# EAGLE design esptoy_v1 (EAGLE 7.1.0)
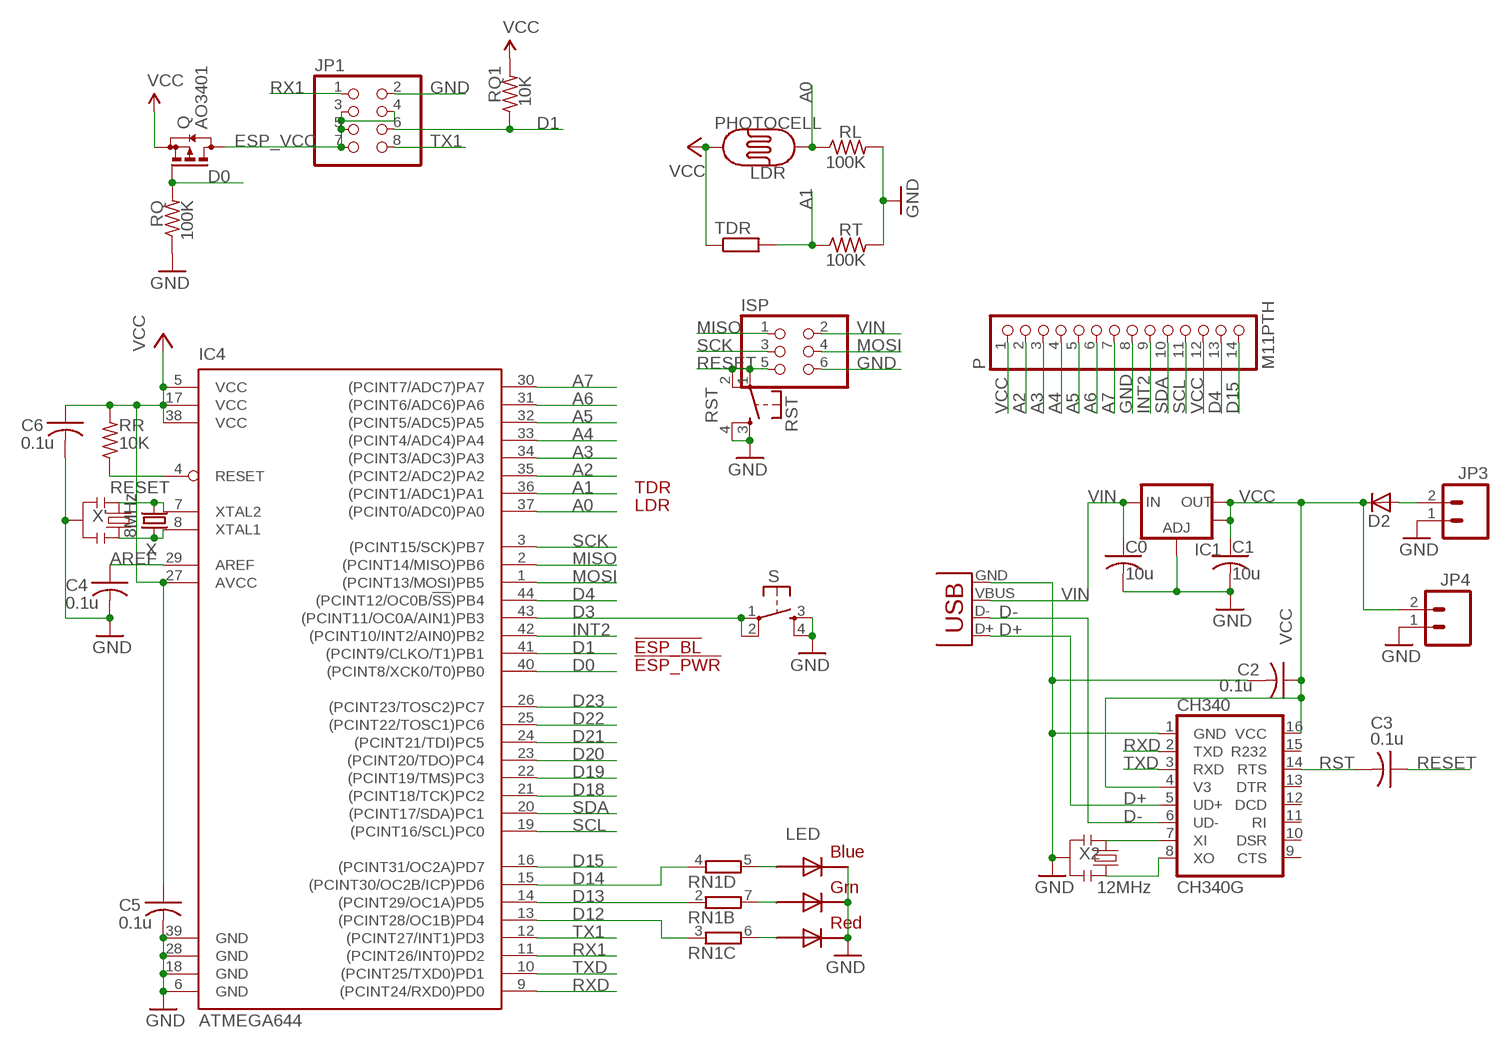
[diagram p0: schematic, sheet 1]

## Parts
C0  10u  C-USC0805K  [C0805K]
C1  10u  C-USC0805K  [C0805K]
C2  0.1u  C-USC0603  [C0603]
C3  0.1u  C-USC0603  [C0603]
C4  0.1u  C-USC0603  [C0603]
C5  0.1u  C-USC0603K  [C0603K]
C6  0.1u  C-USC0603  [C0603]
CH340  CH340G  [SO16]
D2  DIODESMA  [SMA-DIODE]
IC1  V_REG_LM1117SOT223  [SOT223]
IC4  ATMEGA644  ATMEGA644A  [TQFP44]
ISP  PINHD-2X3  [2X03]
JP1  PINHD-2X4  [2X04]
JP3  M02-JST-2MM-SMT  [S2B-PH]
JP4  M02PTH  [1X02]
LDR  PHOTOCELL  PHOTOCELLPTH  [PHOTOCELL]
LED  RGBLED5050  [RGBLED5050]
P  M11PTH  PINHD-1X14-CB  [1X14-CB]
Q  AO3401  BSS84  [SOT23]
RL  100K  R-US_R0805  [R0805]
RN1  4R-NEXB38V  [EXB38V]
RQ  100K  R-US_R0805  [R0805]
RQ1  10K  R-US_R0603  [R0603]
RR  10K  R-US_R0603  [R0603]
RST  RST  TAC_SWITCHSMD  [TACTILE_SWITCH_SMD]
RT  100K  R-US_R0805  [R0805]
S  TAC_SWITCHSMD  [TACTILE_SWITCH_SMD]
TDR  R-EU_V526-0  [V526-0]
X  8MHz  CRYSTALTC26V  [TC26V]
X1  USBSMD  [USB-MINIB]
X2  12MHz  RESONATORSMD  [RESONATOR-SMD]
X'  12MHz  RESONATORSMD  [RESONATOR-SMD]

## Nets
A0: IC4.37((PCINT0/ADC0)PA0) LDR.1 RL.1
A1: IC4.36((PCINT1/ADC1)PA1) RT.1 TDR.2
A2: IC4.35((PCINT2/ADC2)PA2) P.2
A3: IC4.34((PCINT3/ADC3)PA3) P.3
A4: IC4.33((PCINT4/ADC4)PA4) P.4
A5: IC4.32((PCINT5/ADC5)PA5) P.5
A6: IC4.31((PCINT6/ADC6)PA6) P.6
A7: IC4.30((PCINT7/ADC7)PA7) P.7
AREF: C4.1 IC4.29(AREF)
D0: IC4.40((PCINT8/XCK0/T0)PB0) Q.1(G) RQ.2
D1: IC4.41((PCINT9/CLKO/T1)PB1) JP1.6 RQ1.1
D3: IC4.43((PCINT11/OC0A/AIN1)PB3) S.1 S.2
D4: IC4.44((PCINT12/OC0B/!SS!)PB4) P.13
D12: IC4.13((PCINT28/OC1B)PD4) RN1.3
D13: IC4.14((PCINT29/OC1A)PD5) RN1.2
D14: IC4.15((PCINT30/OC2B/ICP)PD6) RN1.4
D15: IC4.16((PCINT31/OC2A)PD7) P.14
D18: IC4.21((PCINT18/TCK)PC2)
D19: IC4.22((PCINT19/TMS)PC3)
D20: IC4.23((PCINT20/TDO)PC4)
D21: IC4.24((PCINT21/TDI)PC5)
D22: IC4.25((PCINT22/TOSC1)PC6)
D23: IC4.26((PCINT23/TOSC2)PC7)
D+: CH340.5(UD+) X1.D+
D-: CH340.6(UD-) X1.D-
ESP_VCC [power]: JP1.3 JP1.4 JP1.5 JP1.7 Q.3(D)
GND: C0.2 C1.2 C2.2 C4.2 C5.2 C6.2 CH340.1(GND) IC1.1(ADJ) IC4.6(GND) IC4.18(GND) IC4.28(GND) IC4.39(GND) ISP.6 JP1.2 JP3.1 JP4.1 LED.4(BLUE_C) LED.5(RED_C) LED.6(GREEN_C) P.8 RL.2 RQ.1 RST.3 RST.4 RT.2 S.3 S.4 X1.GND X2.2 X'.2
INT2: IC4.42((PCINT10/INT2/AIN0)PB2) P.9
MISO: IC4.2((PCINT14/MISO)PB6) ISP.1
MOSI: IC4.1((PCINT13/MOSI)PB5) ISP.4
N$1 [power]: D2.A JP3.2
N$2: LED.3(BLUE_A) RN1.5
N$6: LED.1(GREEN_A) RN1.7
N$7: LED.2(RED_A) RN1.6
N$11: CH340.7(XI) X2.1
N$13: CH340.8(XO) X2.3
N$15: IC4.7(XTAL2) X'.1 X.2
N$19: IC4.8(XTAL1) X'.3 X.1
RESET: C3.1 IC4.4(RESET) ISP.5 RR.1 RST.1 RST.2
RST: C3.2 CH340.14(RTS)
RX1: IC4.11((PCINT26/INT0)PD2) JP1.1
RXD: CH340.2(TXD) IC4.9((PCINT24/RXD0)PD0)
SCK: IC4.3((PCINT15/SCK)PB7) ISP.3
SCL: IC4.19((PCINT16/SCL)PC0) P.11
SDA: IC4.20((PCINT17/SDA)PC1) P.10
TX1: IC4.12((PCINT27/INT1)PD3) JP1.8
TXD: CH340.3(RXD) IC4.10((PCINT25/TXD0)PD1)
VCC [power]: C1.1 C2.1 C5.1 C6.1 CH340.4(V3) CH340.16(VCC) D2.C IC1.2(OUT) IC1.4(OUT) IC4.5(VCC) IC4.17(VCC) IC4.27(AVCC) IC4.38(VCC) JP4.2 LDR.2 P.1 P.12 Q.2(S) RQ1.2 RR.2 TDR.1
VIN [power]: C0.1 IC1.3(IN) ISP.2 X1.VBUS
Unconnected: CH340.9(CTS) CH340.10(DSR) CH340.11(RI) CH340.12(DCD) CH340.13(DTR) CH340.15(R232) RN1.1 RN1.8

## Notes on the sheet
- TDR
- LDR
- !ESP_BL
- !ESP_PWR

## Library data of the parts
C0 C1 = adafruit2013:C-US: CAPACITOR, American symbol
C2-C6 = adafruit:C-US: CAPACITOR, American symbol
CH340 = SparkFunNew:CH340
D2 = SparkFun:DIODE: Diode These are standard reverse protection diodes and small signal diodes. SMA package can handle up to about 1A. SOD-323 can handle about 200mA. What the SOD-323 package when ordering, there are some mfgs out there that are 5-pin packages.
IC1 = SparkFun:V_REG_LM1117: Voltage Regulator LM1117 Standard adjustable voltage regulator but in SMD form. Spark Fun Electronics SKU : COM-00595
IC4 = atmel:ATMEGA644: 8-bit Microcontroller with 64K Bytes In-System Programmable Flash Source: http://www.atmel.com/dyn/resources/prod_documents/doc2593.pdf; MPN: ATMEGA644PV-10AU; OC_FARNELL: 1455123; OC_NEWARK: 58M3748
ISP = pinhead:PINHD-2X3: PIN HEADER
JP1 = pinhead:PINHD-2X4: PIN HEADER
JP3 JP4 = SparkFun:M02: Header 2 Standard 2-pin 0.1" header. Use with straight break away headers (SKU : PRT-00116), right angle break away headers (PRT-00553), swiss pins (PRT-00743), machine pins (PRT-00117), and female headers (PRT-00115). Molex polarized connector foot print use with SKU : PRT-08233 with associated crimp pins and housings.
LDR = SparkFunNew:PHOTOCELL: Photocell Also known as a CdS photoresistor. This is a low cost way to detect light levels. Resistance decreases with more incoming light. SparkFun SKU: SEN-09088
LED = adafruit:RGBLED: For 5050 RGB LEDs, the order of the LEDs may vary from one manufacturer to another!
P = adafruit:PINHD-1X14: PIN HEADER
Q = transistor-small-signal:BSS84: P-CHANNEL MOS FET
RL RQ RQ1 RR RT = adafruit2013:R-US_: RESISTOR, American symbol
RN1 = resistor-dil:4R-N: Array Chip Resistor Source: RS Component / Phycomp; OC_FARNELL: unknown; OC_NEWARK: unknown
RST S = SparkFunNew:TAC_SWITCH: Momentary Switch Button commonly used for reset or general input. Spark Fun Electronics SKU : COM-00097
TDR = resistor:R-EU_: RESISTOR, European symbol; SPICEPREFIX: R
X = crystal:CRYSTAL: CRYSTAL; OC_FARNELL: unknown; OC_NEWARK: unknown
X1 = SparkFun:USB: USB Connectors USB-B-PTH is fully proven SKU : PRT-00139 USB-miniB is fully proven SKU : PRT-00587 USB-A-PCB is untested. USB-A-H is throughly reviewed, but untested. Spark Fun Electronics SKU : PRT-00437 USB-B-SMT is throughly reviewed, but untested. Needs silkscreen touching up. USB-A-S has not been used/tested USB-MB-H has not been used/tested
X2 X' = SparkFunNew:RESONATOR: Resonator Small SMD resonator. This is the itty bitty 10/20MHz resonators with built in caps. CSTCE10M0G55 and CSTCE20M0V53. Footprint has been reviewed closely but hasn't been tested yet.

## Net classes
0 default: width 0.178 mm, clearance 0.178 mm
1 power: width 0.305 mm, clearance 0.203 mm

## Board
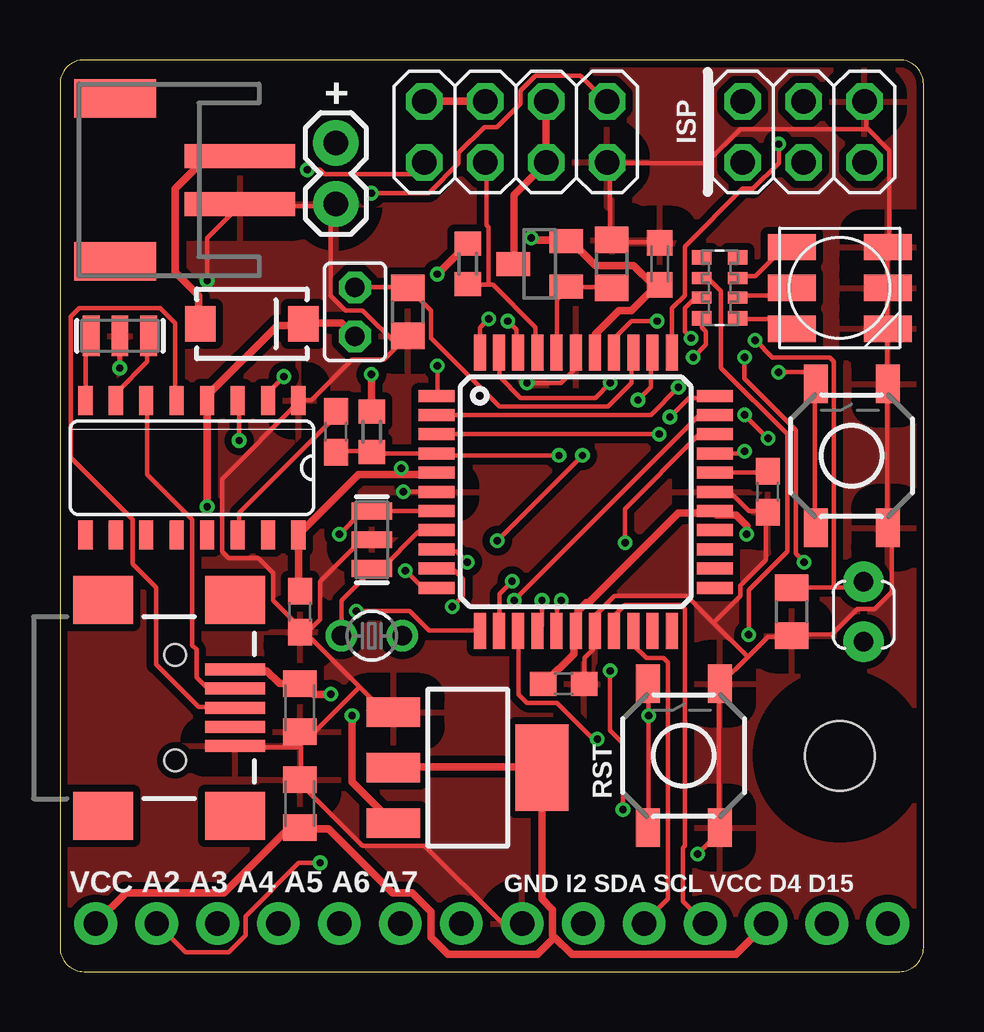
[diagram p1: board, top side]
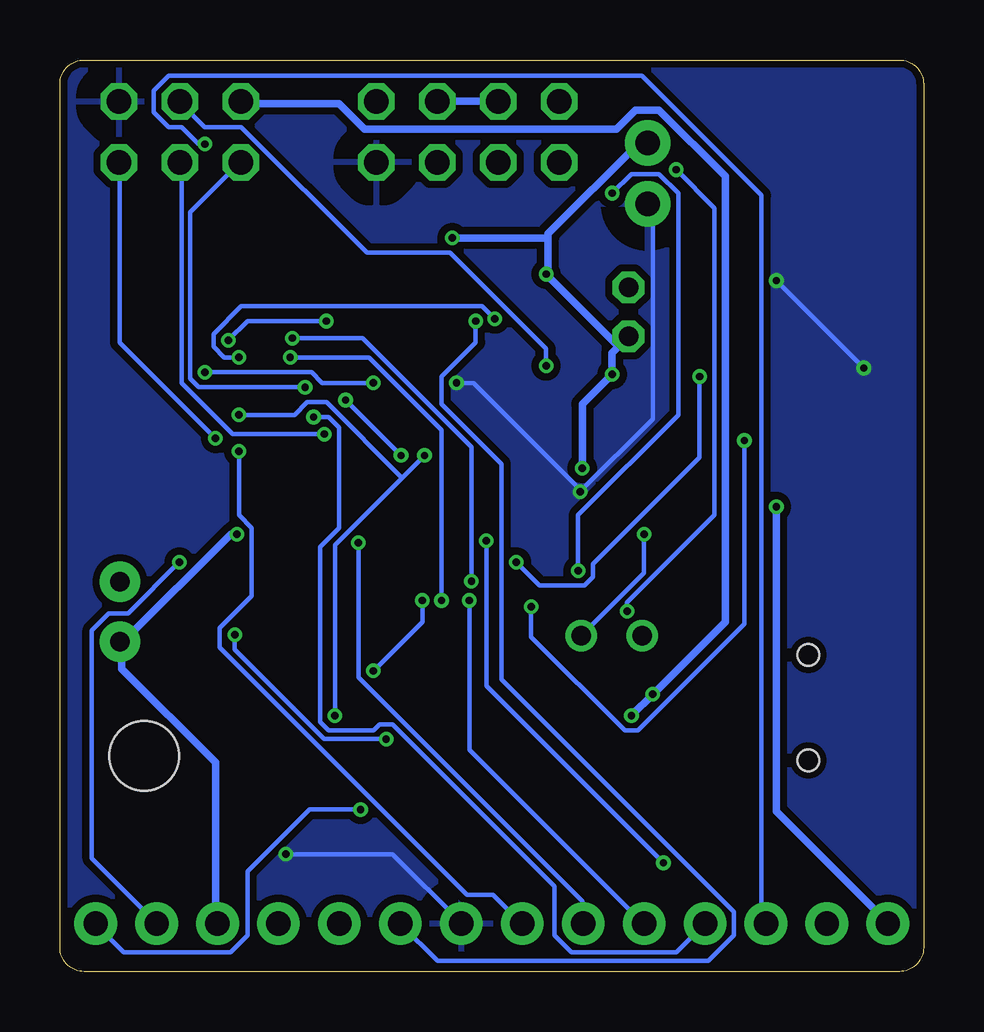
[diagram p2: board, bottom side, seen from below]

Size 36 x 38 mm. Coordinates in mm from the lower left corner, seen from the top.
Outline: 1,0 35,0 arc90 36,1 36,37 arc90 35,38 1,38 arc90 0,37 0,1 arc90 1,0
Copper layers (1*16): Top 0.035mm / dielectric 1.5mm / Bottom 0.035mm
Design rules "Fusion_eagle_rule_v1.1 *": minimum track width 6mil, minimum drill 12mil, track to track 6mil, track to pad 6mil, pad to pad 6mil, via to via 6mil, smd to smd 0mil, copper to edge 10mil, drill to drill 10mil, minimum pad ring 10mil, minimum via ring 6mil, stop-mask expansion 2mil, vias tented up to drill 100mil, thermal gap 40mil
Holes 2.9 mm at 32.5,9
tRestrict: area 29.2,5.7 to 35.8,12.3
vRestrict: area 0.4,3.2 to 30.4,4.2

### Footprints (pad centres in the part's own frame; a part is rotated, then mirrored left to right if it is on the bottom)
C0805K = smd 1.1 x 1.4: 1 -1,0; 2 1,0
C0603 = smd 1.1 x 1: 1 -0.85,0; 2 0.85,0
C0603K = smd 1.05 x 1.08: 1 -0.875,0; 2 0.875,0
SO16 = smd 0.6 x 1.2: 1 -4.445,-2.8; 2 -3.175,-2.8; 3 -1.905,-2.8; 4 -0.635,-2.8; 5 0.635,-2.8; 6 1.905,-2.8; 7 3.175,-2.8; 8 4.445,-2.8; 9 4.445,2.8; 10 3.175,2.8; 11 1.905,2.8; 12 0.635,2.8; 13 -0.635,2.8; 14 -1.905,2.8; 15 -3.175,2.8; 16 -4.445,2.8
SMA-DIODE = smd 1.27 x 1.47: A -2.15,0; C 2.15,0
SOT223 = smd 1.219 x 2.235: 1 -2.311,-3.099; 2 0,-3.099; 3 2.311,-3.099 | smd 3.6 x 2.2: 4 0,3.099
TQFP44 = smd 1.5 x 0.5: 1 -5.8,4; 2 -5.8,3.2; 3 -5.8,2.4; 4 -5.8,1.6; 5 -5.8,0.8; 6 -5.8,0; 7 -5.8,-0.8; 8 -5.8,-1.6; 9 -5.8,-2.4; 10 -5.8,-3.2; 11 -5.8,-4; 23 5.8,-4; 24 5.8,-3.2; 25 5.8,-2.4; 26 5.8,-1.6; 27 5.8,-0.8; 28 5.8,0; 29 5.8,0.8; 30 5.8,1.6; 31 5.8,2.4; 32 5.8,3.2; 33 5.8,4 | smd 0.5 x 1.5: 12 -4,-5.8; 13 -3.2,-5.8; 14 -2.4,-5.8; 15 -1.6,-5.8; 16 -0.8,-5.8; 17 0,-5.8; 18 0.8,-5.8; 19 1.6,-5.8; 20 2.4,-5.8; 21 3.2,-5.8; 22 4,-5.8; 34 4,5.8; 35 3.2,5.8; 36 2.4,5.8; 37 1.6,5.8; 38 0.8,5.8; 39 0,5.8; 40 -0.8,5.8; 41 -1.6,5.8; 42 -2.4,5.8; 43 -3.2,5.8; 44 -4,5.8
2X03 = drill 1.016 octagon: 1 -2.54,-1.27; 2 -2.54,1.27; 3 0,-1.27; 4 0,1.27; 5 2.54,-1.27; 6 2.54,1.27
2X04 = drill 1.016 octagon: 1 -3.81,-1.27; 2 -3.81,1.27; 3 -1.27,-1.27; 4 -1.27,1.27; 5 1.27,-1.27; 6 1.27,1.27; 7 3.81,-1.27; 8 3.81,1.27
S2B-PH = smd 1 x 4.6: 1 -1,-3.7; 2 1,-3.7 | smd 1.6 x 3.4: NC1 -3.4,1.5; NC2 3.4,1.5
1X02 = drill 1.016 pad 1.88: 1 0,0; 2 2.54,0
PHOTOCELL = drill 0.8 pad 1.676: 1 -1.246,0; 2 1.246,0
RGBLED5050 = smd 2 x 1.1: 1 -2,1.7; 2 -2,0; 3 -2,-1.7; 4 2,-1.7; 5 2,0; 6 2,1.7
1X14-CB = drill 1.016 pad 1.778: 1 -16.51,0; 2 -13.97,0; 3 -11.43,0; 4 -8.89,0; 5 -6.35,0; 6 -3.81,0; 7 -1.27,0; 8 1.27,0; 9 3.81,0; 10 6.35,0; 11 8.89,0; 12 11.43,0; 13 13.97,0; 14 16.51,0
SOT23 = smd 1 x 1.4: 1 -0.95,-1.1; 2 0.95,-1.1; 3 0,1.1
R0805 = smd 1.1 x 1.4: 1 -1,0; 2 1,0
EXB38V = smd 0.6 x 0.8: 1 -1.275,-0.75; 4 1.275,-0.75; 5 1.275,0.75; 8 -1.275,0.75 | smd 0.5 x 0.8: 2 -0.4,-0.75; 3 0.4,-0.75; 6 0.4,0.75; 7 -0.4,0.75
R0603 = smd 1 x 1.1: 1 -0.85,0; 2 0.85,0
TACTILE_SWITCH_SMD = smd 1.6 x 1: 1 -3,1.5; 2 3,1.5; 3 -3,-1.5; 4 3,-1.5
V526-0 = drill 0.813 octagon: 1 -1.016,0; 2 1.016,0
TC26V = drill 0.813: 1 -1.27,0; 2 1.27,0
USB-MINIB = smd 2.5 x 0.5: D+ 2.5,0; D- 2.5,0.8; GND 2.5,-1.6; ID 2.5,-0.8; VBUS 2.5,1.6 | smd 2.5 x 2: GND@1 -3,-4.5; GND@2 -3,4.5; GND@3 2.5,4.5; GND@4 2.5,-4.5 | hole 0.9: 0,2.2; 0,-2.2
RESONATOR-SMD = smd 0.7 x 1.7: 1 -1.2,0; 2 0,0; 3 1.2,0

### Placement (x,y rotation side)
C0  10,11 270 top
C1  10,7 90 top
C2  10,15 270 top
C3  11.5,22.5 90 top
C4  29.5,20 270 top
C5  25,29.5 90 top
C6  21,12 0 top
CH340  5.5,21 180 top
D2  8,27 0 top
IC1  17,8.5 270 top
IC4  21.5,20 0 top
ISP  31,35 0 top
JP1  19,35 180 top
JP3  3.8,33 90 top
JP4  11.5,32 90 top
LDR  33.5,15 270 top
LED  32.5,28.5 0 top
P  18,2 0 top
Q  20,29.5 90 top
RL  30.5,15 270 top
RN1  27.5,28.5 270 top
RQ  23,29.5 270 top
RQ1  17,29.5 90 top
RR  13,22.5 90 top
RST  26,9 90 top
RT  14.5,27.5 270 top
S  33,21.5 90 top
TDR  12.3,27.5 90 top
X  13,14 0 top
X1  4.8,11 0 top
X2  2.5,26.5 180 top
X'  13,18 270 top

### Tracks (layer width: path | path; a pad name or v marks a point on that pad's centre or on a via)
A0  (via drill 0.3)
  Top 0.178: 32.27,16 33.25,16 33.43,16.18 LDR.1 | 32.27,16 30.58,16 RL.1 | v24.89,27.11 23.82,27.11 23.11,26.4 23.11,25.87 IC4.37 | v28.98,26.31 29.69,25.6 32.09,25.6 32.27,25.43 32.27,16
  Bottom 0.178: v24.89,27.11 28.18,27.11 v28.98,26.31
A1
  Top 0.178: TDR.2 12.36,28.54 14.49,28.54 RT.1 14.58,28.45 15.47,27.56 15.47,26.4 18.31,23.56 22.85,23.56 23.82,24.54 23.82,25.78 IC4.36
A2  (via drill 0.3)
  Top 0.178: v24.09,23.82 24.62,24.36 24.62,25.78 IC4.35 | v18.22,17.96 v21.78,21.51 | v10.85,4.53 9.96,4.53 7.73,2.31 7.73,1.51 7.02,0.8 5.25,0.8 4.09,1.96 P.2
  Bottom 0.178: v21.78,21.51 v24.09,23.82 | v18.22,17.96 18.22,11.91 v10.85,4.53
A3  (via drill 0.3)
  Top 0.178: v29.96,34.49 29.96,33.69 28.89,32.63 28.45,32.63 26.05,30.23 26.05,28.18 25.51,27.65 25.51,25.87 IC4.34
  Bottom 0.178: v29.96,34.49 30.23,34.49 30.94,35.2 31.47,35.2 32.09,35.83 32.09,36.72 31.47,37.34 11.73,37.34 6.76,32.36 6.76,2.22 6.58,2.04 P.3
A4  (via drill 0.3)
  Top 0.178: v25.43,23.11 26.23,23.91 27.29,23.91 IC4.33
  Bottom 0.178: v25.43,23.11 24.8,23.11 24.36,22.67 24.36,18.49 25.16,17.69 25.16,10.4 24.8,10.05 22.94,10.05 22.67,10.31 22.14,10.31 15.38,3.56 15.38,1.51 14.67,0.8 10.31,0.8 9.16,1.96 P.4
A5  (via drill 0.3)
  Top 0.178: v18.94,15.47 26.58,23.11 27.29,23.11 IC4.32
  Bottom 0.178: v18.94,15.47 18.94,9.25 11.73,2.04 P.5
A6  (via drill 0.3)
  Top 0.178: v23.56,17.87 23.56,19.29 26.58,22.31 27.29,22.31 IC4.31
  Bottom 0.178: v23.56,17.87 23.56,12.27 14.22,2.93 14.22,2.04 P.6
A7  (via drill 0.3)
  Top 0.178: v28.54,21.69 28.45,21.6 27.38,21.6 IC4.30
  Bottom 0.178: v28.54,21.69 28.54,19.02 28,18.49 28,15.65 29.34,14.31 29.34,13.51 19.02,3.2 17.96,3.2 16.8,2.04 P.7
AREF
  Top 0.178: C4.1 29.43,20.8 27.38,20.8 IC4.29
D0
  Top 0.178: RQ.2 22.94,28.54 21.16,28.54 Q.1 21.16,28.45 20.71,28 20.71,25.87 IC4.40
D1
  Top 0.178: 17.87,28.63 18.05,28.63 19.82,26.85 19.82,25.87 IC4.41 | 17.87,28.63 17.07,28.63 RQ1.1 | 17.87,28.63 17.87,31.03 17.78,31.11 17.78,33.69 JP1.6
D3  (via drill 0.3)
  Top 0.178: v22.94,24.54 22.31,23.91 19.2,23.91 18.31,24.8 18.31,25.78 IC4.43 | v29.96,24.98 31.03,24.98 31.47,24.54 S.2 31.47,24.45 31.47,18.58 S.1
  Bottom 0.178: v22.94,24.54 25.07,24.54 25.51,24.98 v29.96,24.98
D4  (via drill 0.3)
  Top 0.178: v17.87,27.2 17.51,26.85 17.51,25.87 IC4.44 | v28.54,25.6 28.54,24.71 30.67,22.58 30.67,17.42 v31.03,17.07
  Bottom 0.178: v17.87,27.2 18.4,27.74 28.45,27.74 29.6,26.58 29.6,26.05 29.16,25.6 v28.54,25.6 | v31.03,17.07 33.16,14.94 33.96,14.94 34.67,14.22 34.67,4.71 32,2.04 P.13
D12  (via drill 0.3)
  Top 0.178: v26.31,26.4 26.05,26.67 26.05,27.65 26.49,28.09 26.67,28.09 RN1.3 | v18.85,16.27 18.31,15.73 18.31,14.22 IC4.13
  Bottom 0.178: v26.31,26.4 23.38,26.4 18.85,21.87 v18.85,16.27
D13  (via drill 0.3)
  Top 0.178: v28.71,14.05 28.71,15.91 30.32,17.51 30.32,22.4 27.56,25.16 27.56,28.36 27.03,28.89 RN1.2 | v22.4,9.69 22.23,9.69 20.71,11.2 19.47,11.2 19.11,11.56 19.11,14.13 IC4.14
  Bottom 0.178: v28.71,14.05 28.71,13.42 24.98,9.69 v22.4,9.69
D14  (via drill 0.3)
  Top 0.178: v26.4,25.6 26.94,26.14 26.94,26.67 26.76,26.85 26.76,27.2 RN1.4 | v20.09,15.47 20.09,14.4 19.91,14.22 IC4.15
  Bottom 0.178: v26.4,25.6 23.11,25.6 20.09,22.58 v20.09,15.47
D15  (via drill 0.3)
  Top 0.178: v20.89,15.47 20.71,15.29 20.71,14.22 IC4.16 | v22.94,12.54 22.94,10.05 23.47,9.51 v23.47,6.76
  Bottom 0.178: v20.89,15.47 20.89,14.58 v22.94,12.54 | v23.47,6.76 25.6,6.76 28.18,4.18 28.18,1.51 28.89,0.8 33.34,0.8 34.49,1.96 P.14
D+
  Top 0.178: CH340.5 4.8,23.82 4.8,27.03 4.18,27.65 0.8,27.65 0.45,27.29 0.45,21.43 3.02,18.85 3.02,16.98 4,16 4,12.8 5.78,11.02 7.29,11.02 X1.D+
D-
  Top 0.178: CH340.6 3.65,23.74 3.65,20.71 5.51,18.85 5.51,13.6 5.69,13.42 5.69,12.27 6.13,11.82 7.29,11.82 X1.D-
ESP_VCC
  Top 0.305: JP1.7 15.2,36.27 17.69,36.27 JP1.5 | Q.3 18.94,29.52 18.94,32.36 20.27,33.69 JP1.4 20.27,33.87 20.27,36.18 JP1.3
  Bottom 0.305: JP1.5 17.78,36.27 JP1.3
GND  (via drill 0.3)
  Top 0.178: IC4.28 27.38,19.91 28,19.91 28.71,19.2 29.43,19.2 C4.2 29.43,19.11 29.43,17.16 28.36,16.09 28.36,15.65 27.25,14.54 | C6.2 21.87,12 21.87,13.07 22.23,13.42 22.23,14.13 IC4.18 22.31,14.22 22.31,14.85 23.11,15.65 26.14,15.65 27.25,14.54 | 28.67,13.11 27.56,12 RST.4 27.47,11.91 27.47,6.04 RST.3 27.47,5.96 27.47,5.78 v26.58,4.89 | 28.67,13.11 29.52,13.96 30.49,13.96 RL.2 30.58,14.05 32.18,14.05 33.25,15.11 33.96,15.11 34.67,15.82 34.67,18.4 34.58,18.49 S.3 34.49,18.58 34.49,24.45 S.4 34.49,24.54 34.49,26.76 LED.4 34.49,26.85 34.49,28.45 LED.5 34.49,28.54 34.49,30.14 LED.6 34.58,30.23 34.58,34.23 33.65,35.16 | 28.67,13.11 27.25,14.54 | C5.2 24.98,30.4 23.11,30.4 23.02,30.49 RQ.1 22.94,30.58 22.94,33.6 22.85,33.69 JP1.2 22.94,33.69 26.94,33.69 28.36,35.12 33.6,35.12 33.65,35.16 | 33.65,35.16 33.6,35.2 33.6,36.18 ISP.6 | 10.05,9.34 10.05,9.96 C0.2 10.13,9.96 10.58,9.96 12.49,11.87 | 10.05,9.34 10.05,8 C1.2 9.96,7.91 12.62,5.25 15.2,5.25 18.4,2.04 19.2,2.04 P.8 | 10.05,9.34 7.38,9.34 X1.GND | 12.49,11.87 13.51,10.85 13.87,10.85 IC1.1 | 12.49,11.87 10.22,14.13 10.05,14.13 C2.2 | X'.2 12.98,17.96 12.54,17.96 10.85,16.27 10.85,14.67 10.31,14.13 C2.2 | v2.49,25.16 2.49,26.49 X2.2 | v6.13,28.8 6.13,30.58 7.47,31.91 JP3.1 7.56,31.91 11.38,31.91 JP4.1 11.47,31.91 11.29,31.74 11.29,28.18 11.91,27.56 12.62,27.56 14.05,26.14 RT.2 13.51,25.51 12.18,25.51 10.49,23.82 9.96,23.82 CH340.1 9.96,23.74 6.76,20.54 6.76,17.51 7.02,17.25 8.27,17.25 8.89,16.62 8.89,15.47 9.96,14.4 9.96,14.22 C2.2 | v14.31,20 15.65,20 IC4.6 | v19.47,24.54 20.89,24.54 21.43,25.07 21.43,25.78 IC4.39
  Bottom 0.178: v6.13,28.8 v2.49,25.16 | JP4.1 11.47,31.91 11.29,31.74 11.29,23.02 v14.31,20 14.31,20.09 18.76,24.54 v19.47,24.54 | v26.58,4.89 22.14,4.89 19.29,2.04 P.8
  pour Top (isolate 0.305): 0,38 36,38 36,0 0,0
  pour Bottom (isolate 0.305): 0,38 36,38 36,0 0,0
INT2  (via drill 0.3)
  Top 0.178: v18.67,27.11 19.02,26.76 19.02,25.87 IC4.42
  Bottom 0.178: v18.67,27.11 18.67,26.23 20.09,24.8 20.09,23.65 17.6,21.16 17.6,12.18 7.91,2.49 7.91,1.51 8.98,0.45 20.27,0.45 21.78,1.96 P.9
MISO  (via drill 0.3)
  Top 0.178: v25.78,24.36 24.62,23.2 15.73,23.2 IC4.2
  Bottom 0.178: v25.78,24.36 30.23,24.36 30.58,24.71 30.58,31.65 28.54,33.69 ISP.1
MOSI  (via drill 0.3)
  Top 0.178: v15.73,25.25 15.73,24 IC4.1
  Bottom 0.178: v15.73,25.25 15.73,25.96 19.74,29.96 23.2,29.96 28.45,35.2 29.96,35.2 30.94,36.18 ISP.4
N$1
  Top 0.305: D2.A 5.78,27.03 5.78,28.18 4.8,29.16 4.8,32.63 6.13,33.96 7.47,33.96 JP3.2
N$2
  Top 0.178: RN1.5 28.27,27.2 30.14,27.2 30.49,26.85 LED.3
N$6
  Top 0.178: RN1.7 28.27,28.98 28.98,28.98 30.14,30.14 30.49,30.14 LED.1
N$7
  Top 0.178: RN1.6 28.27,28.18 30.23,28.18 30.49,28.45 LED.2
N$11
  Top 0.178: CH340.7 2.4,23.82 2.4,24.18 3.65,25.43 3.65,26.49 X2.1
N$13
  Top 0.178: CH340.8 1.07,23.82 1.07,26.31 1.25,26.49 X2.3
N$15  (via drill 0.3)
  Top 0.178: IC4.7 15.65,19.2 13.07,19.2 X'.1 12.98,19.11 12.54,19.11 v11.65,18.22
  Bottom 0.178: v11.65,18.22 11.65,16.62 14.22,14.05 X.2
N$19
  Top 0.178: IC4.8 15.65,18.31 14.94,18.31 13.42,16.8 13.07,16.8 X'.3 12.98,16.71 11.73,15.47 11.73,14.05 X.1
RESET  (via drill 0.3)
  Top 0.178: C3.1 11.56,21.69 12.98,21.69 RR.1 13.07,21.6 15.65,21.6 IC4.4 15.73,21.51 v20.8,21.51 | RST.1 24.54,6.04 v24.54,10.67 24.54,11.91 RST.2 | v28.54,23.2 v29.52,22.23
  Bottom 0.178: 21.74,20.58 24.54,17.78 v24.54,10.67 | 21.74,20.58 v20.8,21.51 | v29.52,22.23 33.52,26.23 33.52,33.69 ISP.5 | v28.54,23.2 26.23,23.2 25.69,23.74 24.89,23.74 21.74,20.58
RST
  Top 0.178: C3.2 11.47,23.29 11.47,23.11 7.47,19.11 7.47,18.22 CH340.14
RX1  (via drill 0.3)
  Top 0.178: v14.4,16.71 15.11,16 15.65,16 IC4.11 | v12.98,32.45 15.38,32.45 16.62,33.69 16.62,34.14 17.69,35.2 18.22,35.2 19.2,36.18 19.2,36.72 19.82,37.34 21.69,37.34 22.76,36.27 JP1.1
  Bottom 0.178: v14.4,16.71 14.4,19.02 10.22,23.2 10.22,32.45 11.02,33.25 12.18,33.25 v12.98,32.45
RXD  (via drill 0.3)
  Top 0.178: v9.34,24.8 8.71,24.18 8.71,23.82 CH340.2 | v16.98,17.07 16.54,17.51 15.73,17.51 IC4.9
  Bottom 0.178: v9.34,24.8 9.34,21.43 13.78,16.98 13.78,16.45 14.13,16.09 16,16.09 v16.98,17.07
SCK  (via drill 0.3)
  Top 0.178: v24.98,22.4 15.73,22.4 IC4.3
  Bottom 0.178: v24.98,22.4 28.8,22.4 30.94,24.54 30.94,33.69 ISP.3
SCL
  Top 0.178: IC4.19 23.11,14.22 23.11,14.85 23.56,15.29 25.87,15.29 26.05,15.11 26.05,5.25 25.96,5.16 25.96,2.93 26.85,2.04 P.11
SDA
  Top 0.178: IC4.20 23.91,14.13 23.91,13.6 24.45,13.07 25.16,13.07 25.34,12.89 25.34,3.02 24.36,2.04 P.10
TX1  (via drill 0.3)
  Top 0.178: v12.36,15.02 14.58,15.02 15.38,14.22 17.42,14.22 IC4.12 | v10.31,33.43 10.85,33.43 11.02,33.25 14.67,33.25 15.11,33.69 JP1.8
  Bottom 0.178: v12.36,15.02 12.36,15.38 8.71,19.02 8.71,31.83 v10.31,33.43
TXD  (via drill 0.3)
  Top 0.178: v7.47,22.14 7.47,23.74 CH340.3 | v16.36,15.2 16.8,15.65 16.8,16.36 16.45,16.71 15.73,16.71 IC4.10
  Bottom 0.178: v7.47,22.14 7.47,14.49 11.91,10.05 12.45,10.05 16.36,13.96 v16.36,15.2
VCC  (via drill 0.3)
  Top 0.305: C2.1 9.96,15.91 9.96,18.14 CH340.16 10.05,18.31 12.45,20.71 14.22,20.71 | 14.22,20.71 15.65,20.71 IC4.5 | IC4.38 22.31,25.87 22.31,26.58 23.29,27.56 23.82,27.56 24.8,28.54 24.98,28.54 C5.1 24.71,28.63 23.91,29.43 22.31,29.43 21.34,30.4 21.16,30.4 Q.2 20.98,30.49 19.74,30.49 v19.65,30.58 | v12.98,24.89 12.98,23.38 RR.2 | v15.73,29.07 16.98,30.32 RQ1.2 | TDR.1 12.27,26.49 11.73,27.03 10.31,27.03 D2.C 10.13,26.94 9.07,26.94 6.22,24.09 6.22,23.82 CH340.4 6.13,23.65 v6.13,19.38 | v14.22,20.98 14.22,20.71 | P.1 1.51,2.04 2.76,3.29 6.84,3.29 9.51,5.96 9.96,5.96 C1.1 10.13,5.96 11.2,5.96 13.87,3.29 14.67,3.29 15.47,2.49 15.47,1.42 16.18,0.71 19.91,0.71 20.62,1.42 | C6.1 20.18,12 21.43,13.25 21.43,14.13 IC4.17 21.6,14.31 21.6,15.02 21.96,15.38 22.05,15.38 25.78,19.11 27.29,19.11 IC4.27 27.38,19.02 28.18,19.02 28.63,18.58 v28.63,18.22 | IC1.2 13.96,8.53 20.09,8.53 IC1.4 20.09,8.36 20.09,3.02 20.54,2.58 20.54,1.51 20.62,1.42 | 20.62,1.42 21.34,0.71 28.18,0.71 29.43,1.96 P.12
  Bottom 0.305: 15.65,30.58 15.65,29.16 v15.73,29.07 12.8,26.14 TDR.1 12.36,26.4 12.98,25.78 v12.98,24.89 14.22,23.65 v14.22,20.98 | 15.65,30.58 15.65,30.76 11.91,34.49 11.56,34.49 JP4.2 | 15.65,30.58 v19.65,30.58 | P.12 29.52,2.04 29.52,8.71 33.43,12.62 33.43,13.69 LDR.2 33.34,13.78 28.89,18.22 v28.63,18.22 | v6.13,19.38 6.13,6.67 1.51,2.04 P.1
VIN  (via drill 0.3)
  Top 0.305: X1.VBUS 7.38,12.54 8.62,12.54 9.16,12 9.96,12 C0.1 10.13,12 10.58,11.56 v11.29,11.56 | v12.18,10.67 12.18,7.91 13.87,6.22 IC1.3
  Bottom 0.305: v12.18,10.67 v11.29,11.56 8.27,14.58 8.27,33.16 11.02,35.92 12,35.92 12.8,35.12 23.29,35.12 24.36,36.18 28.45,36.18 ISP.2

### Text on the board
tPlace: VCC A2 A3 A4 A5 A6 A7 | GND I2 SDA SCL VCC D4 D15
tNames: +